# Altium schematic sheet 02-MCU.SchDoc
size A; ApprovedDate: 04/02/2019; AssemblyNumber: ECE315-F19
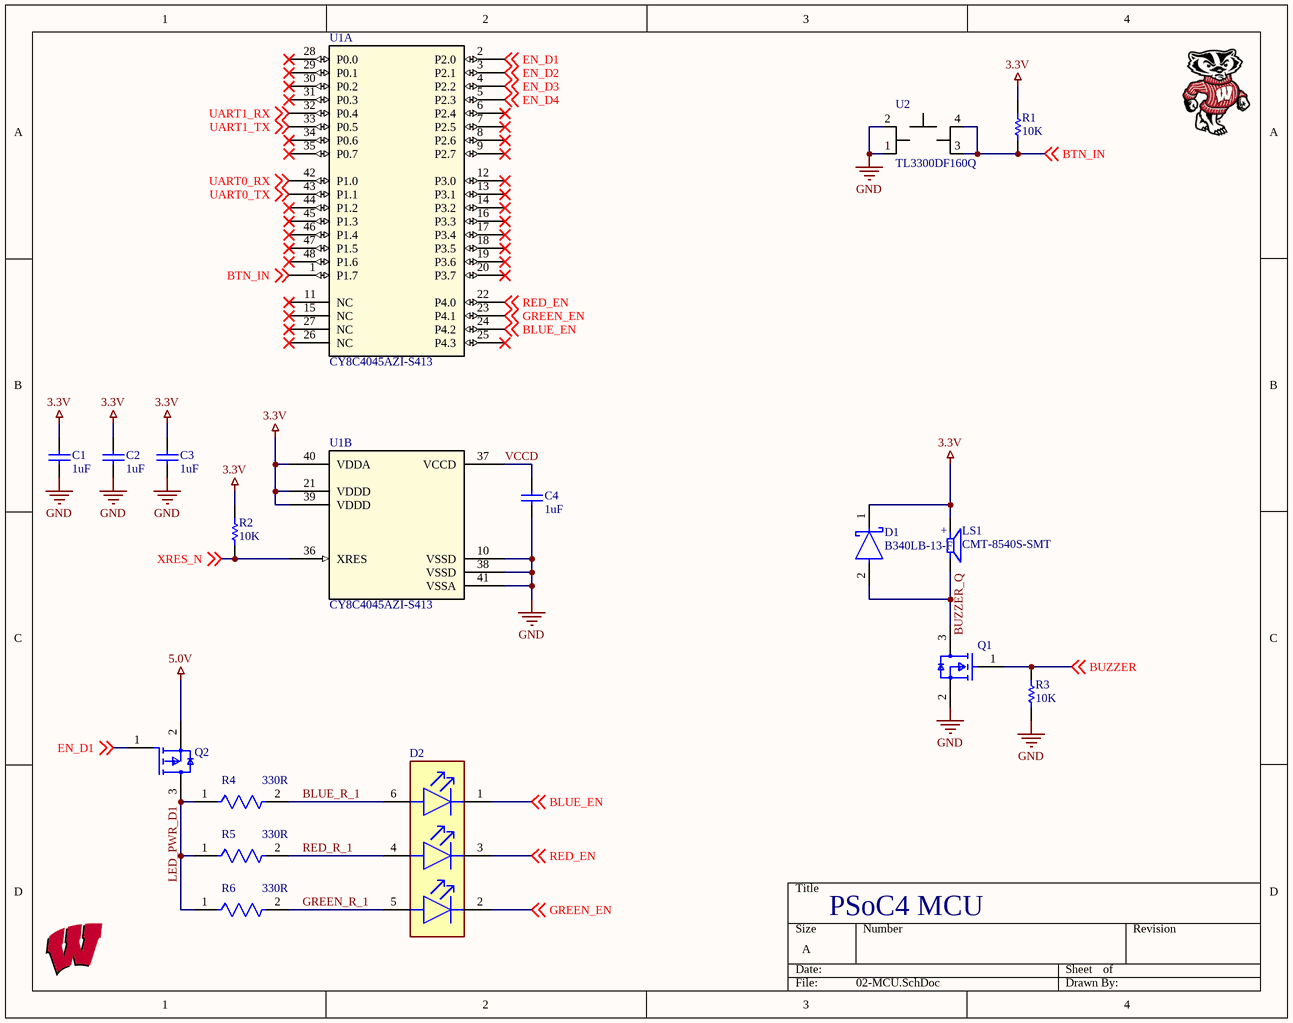
[diagram p0: 02-MCU.SchDoc]

## Parts
C1  Capacitance: 1uF  [CAPC3216X180X50ML20T25]  (hidden comment: C1206C105K3RACTU)
C2  Capacitance: 1uF  [CAPC3216X180X50ML20T25]  (hidden comment: C1206C105K3RACTU)
C3  Capacitance: 1uF  [CAPC3216X180X50ML20T25]  (hidden comment: C1206C105K3RACTU)
C4  Capacitance: 1uF  [CAPC3216X180X50ML20T25]  (hidden comment: C1206C105K3RACTU)
D1  B340LB-13-F  [FP-SMB-MFG]
D2  CLX6F-FKC-CKNNQDGBB7A363  [FP-CLX6F-FKC-CKNNQDGBB7A3-IPC_C]  (value not drawn)
LS1  CMT-8540S-SMT  [CUI_CMT-8540S-SMT]
Q1  2N7002ET1G  [FP-318-08-IPC_A]  (value not drawn)
Q2  DMP3099L-7  [FP-SOT23-IPC_B]  (value not drawn)
R1  Resistance: 10K  [RESC3116X65X40ML10T20]  (hidden comment: RC1206FR-0710KL)
R2  Resistance: 10K  [RESC3116X65X40ML10T20]  (hidden comment: RC1206FR-0710KL)
R3  Resistance: 10K  [RESC3116X65X40ML10T20]  (hidden comment: RC1206FR-0710KL)
R4  Resistance: 330R  [FP-CRCW1206-e3-IPC_A]  (hidden comment: CRCW1206330RFKEA)
R5  Resistance: 330R  [FP-CRCW1206-e3-IPC_A]  (hidden comment: CRCW1206330RFKEA)
R6  Resistance: 330R  [FP-CRCW1206-e3-IPC_A]  (hidden comment: CRCW1206330RFKEA)
U1  CY8C4045AZI-S413  [TQFP48_7X7X1P4_CYP-M]  (parts A,B of 2)
U2  TL3300DF160Q  [TL3300DF160Q]

## Nets
3.3V: C1.2 C2.2 C3.2 D1.1(C) LS1.P R1.2 R2.2 U1.21(VDDD) U1.39(VDDD) U1.40(VDDA)
5.0V: Q2.2(S)
GND: C1.1 C2.1 C3.1 C4.1 Q1.2(Source) R3.1 U1.10(VSSD) U1.38(VSSD) U1.41(VSSA) U2.1 U2.2
BLUE_EN: D2.1(BLUE_C) U1.24(P4.2) ; off-sheet BLUE_EN
BLUE_R_1: D2.6(BLUE_A) R4.2
BTN_IN: R1.1 U1.1(P1.7) U2.3 U2.4(VCCIO) ; off-sheet BTN_IN
BUZZER: Q1.1(Gate) R3.2 ; off-sheet BUZZER
BUZZER_Q: D1.2(A) LS1.N Q1.3(Drain)
EN_D1: Q2.1(G) U1.2(P2.0) ; off-sheet EN_D1
EN_D2: U1.3(P2.1) ; off-sheet EN_D2
EN_D3: U1.4(P2.2) ; off-sheet EN_D3
EN_D4: U1.5(P2.3) ; off-sheet EN_D4
GREEN_EN: D2.2(GREEN_C) U1.23(P4.1) ; off-sheet GREEN_EN
GREEN_R_1: D2.5(GREEN_A) R6.2
LED_PWR_D1: Q2.3(D) R4.1 R5.1 R6.1
RED_EN: D2.3(RED_C) U1.22(P4.0) ; off-sheet RED_EN
RED_R_1: D2.4(RED_A) R5.2
UART0_RX: U1.42(P1.0) ; off-sheet UART0_RX
UART0_TX: U1.43(P1.1) ; off-sheet UART0_TX
UART1_RX: U1.32(P0.4) ; off-sheet UART1_RX
UART1_TX: U1.33(P0.5) ; off-sheet UART1_TX
VCCD: C4.2 U1.37(VCCD)
XRES_N: R2.1 U1.36(XRES) ; off-sheet XRES_N

Not connected (* = marked no-connect by the designer): U1 6(P2.4)* 7(P2.5)* 8(P2.6)* 9(P2.7)* 11(NC)* 12(P3.0)* 13(P3.1)* 14(P3.2)* 15(NC)* 16(P3.3)* 17(P3.4)* 18(P3.5)* 19(P3.6)* 20(P3.7)* 25(P4.3)* 26(NC)* 27(NC)* 28(P0.0)* 29(P0.1)* 30(P0.2)* 31(P0.3)* 34(P0.6)* 35(P0.7)* 44(P1.2)* 45(P1.3)* 46(P1.4)* 47(P1.5)* 48(P1.6)*

## Notes on the sheet
- PSoC4 MCU
- (in symbol CMT-8540S-SMT) +

## Library data of the parts
C1-C4 = CMP-2000-04991-1: Chip Capacitor, 1 uF, +/- 10%, 25 V, -55 to 125 degC, 1206 (3216 Metric), RoHS, Tape and Reel; Manufacturer: Kemet; Temperature Coefficient / Code: +/-15%; Dielectric: X7R; Voltage Rating DC: 25V; Capacitance - nF: 1000nF; Class: Class1; Case Length: 3.2mm; Type: SMDMLCCX7R6.3-250VDCCommericalGrade; Case Width: 1.6mm; Product: GeneralTypeMLCCs; Datasheet URL: https://ciiva.com/datasheet-click-18194173?src=ciiva&sig=6daff8c4; Operating Temperature Range: -55Cto+125C; Series: C1206C; RoHS: Details; Product Category: MultilayerCeramicCapacitorsMLCC-SMD/SMT; Manufacturer URL: http://www.kemet.com/; Minimum Operating Temperature: -55C; Dimensions: 1.6mmWx3.2mmLx1.6mmH; Termination Style: SMD/SMT; Brand: Kemet; Packaging: Reel; Package / Case: 1206(3216metric); Case Code - mm: 3216; Datasheet Version: Jul-14; Factory Pack Quantity: 2000; Package Description: 2-Pin Surface Mount Device, Body 3.2 x 1.6 mm; Tolerance: 10%; Package Reference: 1206; Case Height: 1.6mm; Case Code - in: 1206; Maximum Operating Temperature: +125C; Voltage Rating: 25V; Supplier 1: Digi-Key; Supplier Part Number 1: 399-C1206C105K3RAC7800CT-ND; Manufacturer Part Number: C1206C105K3RACTU; Category: Ceramic Capacitors; Stock 1: 908349; Pricing 1: 1=0.24000, 10=0.16700, 50=0.10000, 100=0.08440, 500=0.05778, 1000=0.05111 (USD); Mount: Surface Mount; Case/Package: 1206; Case Code (Imperial): 1206; Case Code (Metric): 3216; Min Operating Temperature: -55°C; Max Operating Temperature: 125°C; Voltage Rating (DC): 25V; Package Quantity: 1; Termination: SMD/SMT; Construction: Flat; Voltage: 25V; Length: 3.2mm; Width: 0.063inch; Height: 1.6mm; Depth: 1.6mm; Thickness: 0.055inch; Radiation Hardening: No; Reach SVHC Compliant: No; RoHS Compliant: Yes
D1 = CMP-12790-000022-1: DIODE SCHOTTKY 40V 3A SMB; Manufacturer: Diodes Inc.; Max Surge Forward Current: 70A; Value: 180pF; Peak Reverse Current: 2mA; Standoff Height: 0.05mm; Max Junction Temp: +150°C; Forward Voltage: 450mV; Element Configuration: Single; Polarity: Standard; Device Class L2: Diodes; Octopart: https://octopart.com/b340lb-13-f-diodes+inc.-325823; Device Class L1: Discrete Semiconductors; Forward Current: 3A; Automotive: No; Manufacturer Part Number: B340LB-13-F; Temperature: -55°C to +150°C; Temperature Range Low: -55°C; Max Repetitive Reverse Voltage: 40V; Device Class L3: Schottky Diodes; RoHS: TRUE; Height: 2.5mm; ComponentLink2URL: https://www.diodes.com/assets/Datasheets/ds30240.pdf; Package: SMB; Digikey Description: DIODE SCHOTTKY 40V 3A SMB; Lead Free: Yes; Category: Diode; Reverse Voltage: 40V; Mouser Description: Schottky Diodes & Rectifiers 40V 3A; ComponentLink2Description: Datasheet; Footprint Url: https://www.diodes.com/assets/Package-Files/SMB.pdf; Temperature Range High: +150°C; Capacitance: 180pF; Supplier 1: Digi-Key; Supplier Part Number 1: B340LB-FDICT-ND; Stock 1: 168517; Pricing 1: 1=0.43000, 10=0.36500, 100=0.27250, 500=0.21414, 1000=0.16547 (USD); Mount: Surface Mount; Case/Package: SMB; Number of Pins: 2; Weight: 0.00328oz; Min Operating Temperature: -55°C; Max Operating Temperature: 125°C; Max Reverse Current: 2mA; Package Quantity: 3000; Packaging: Tape and Reel; Average Rectified Current: 3A; Max Repetitive Reverse Voltage (Vrrm): 40V; Peak Non-Repetitive Surge Current: 70A; Max Forward Surge Current (Ifsm): 70A; Max Reverse Voltage (DC): 40V; Series: -; Voltage Rating (DC): 40V; Current Rating: 3A; Output Current: 3A; Termination: SMD/SMT; Current: 3A; Voltage: 40V; Length: 4.57mm; Width: 3.94mm; Radiation Hardening: No; Reach SVHC Compliant: Yes; RoHS Compliant: Yes; ComponentLink1URL: https://datasheet.ciiva.com/4715/ds30240-71143-4715794.pdf?src-supplier=Mouser; ComponentLink1Description: https://datasheet.ciiva.com/4715/ds30240-71143-4715794.pdf?src-supplier=Mouser; ComponentLink3URL: https://datasheet.ciiva.com/26949/getdatasheetpartid-146318-26949355.pdf?src-supplier=Verical; ComponentLink3Description: https://datasheet.ciiva.com/26949/getdatasheetpartid-146318-26949355.pdf?src-supplier=Verical; ComponentLink4URL: https://datasheet.ciiva.com/1177/ds30240-1177479.pdf?src-supplier=Element14; ComponentLink4Description: https://datasheet.ciiva.com/1177/ds30240-1177479.pdf?src-supplier=Element14; ComponentLink5URL: https://datasheet.ciiva.com/16380/ds30240-16380877.pdf?src-supplier=Future+Electronics; ComponentLink5Description: https://datasheet.ciiva.com/16380/ds30240-16380877.pdf?src-supplier=Future+Electronics; ComponentLink6URL: https://datasheet.ciiva.com/8303/ds30240-8303077.pdf?src-supplier=Avnet; ComponentLink6Description: https://datasheet.ciiva.com/8303/ds30240-8303077.pdf?src-supplier=Avnet; ComponentLink7URL: https://datasheet.ciiva.com/914/ds30240-914107.pdf?src-supplier=Digi-Key; ComponentLink7Description: https://datasheet.ciiva.com/914/ds30240-914107.pdf?src-supplier=Digi-Key; ComponentLink8URL: https://datasheet.ciiva.com/914/ds30240-914108.pdf?src-supplier=Digi-Key; ComponentLink8Description: https://datasheet.ciiva.com/914/ds30240-914108.pdf?src-supplier=Digi-Key; ComponentLink9URL: https://datasheet.ciiva.com/914/ds30240-914106.pdf?src-supplier=Digi-Key; ComponentLink9Description: https://datasheet.ciiva.com/914/ds30240-914106.pdf?src-supplier=Digi-Key; Supplier 2: Newark; Supplier Part Number 2: 12T1468
D2 = CMP-240906-000003-1: LED RGB 6PLCC SMD; Manufacturer 1: Cree; Lens Style: Flat; Temperature Coefficient: 25ppm/°C; Test Current: 10mA; Color: Blue; Max Power Dissipation: 400mW; Dominant Wavelength: 470nm; Tolerance: 0.1%; Resistance: 49.9R; Forward Voltage: 3V; Luminous Intensity: 240mcd; Case Code (Imperial): 1206; Features: Moisture Resistant; RoHS Compliant: Yes; Case Code (Metric): 3216; Packaging: Cut Tape; Max Operating Temperature: 155°C; Case/Package: SMD/SMT; Mount: Surface Mount; Height: 2.9mm; Resistor Type: Thin Film; Min Operating Temperature: -55°C; Length: 3.4mm; Number of Terminations: 2; Width: 3.4mm; Supplier 1: Digi-Key; Supplier Part Number 1: CLX6F-FKC-CKNNQDGBB7A363CT-ND; Manufacturer Part Number 1: CLX6F-FKC-CKNNQDGBB7A363; RoHS: Yes; Category: Uncategorized; Stock 1: 28879; Pricing 1: 1=0.36000, 10=0.33500, 100=0.30960, 1000=0.27700 (USD); ComponentLink1URL: http://www.farnell.com/datasheets/2813756.pdf?src-supplier=Farnell; ComponentLink1Description: http://www.farnell.com/datasheets/2813756.pdf?src-supplier=Farnell; ComponentLink2URL: http://www.mouser.com/ds/2/90/CLX6F-FKC-1352-1064258.pdf?src-supplier=Mouser; ComponentLink2Description: http://www.mouser.com/ds/2/90/CLX6F-FKC-1352-1064258.pdf?src-supplier=Mouser; ComponentLink3URL: https://www.cree.com/led-components/media/documents/CLX6F-FKC-1352.pdf?src-supplier=Digi-Key; ComponentLink3Description: https://www.cree.com/led-components/media/documents/CLX6F-FKC-1352.pdf?src-supplier=Digi-Key; ComponentLink4URL: http://www.farnell.com/datasheets/2813756.pdf?src-supplier=Element14; ComponentLink4Description: http://www.farnell.com/datasheets/2813756.pdf?src-supplier=Element14; ComponentLink5URL: http://www.farnell.com/datasheets/2813756.pdf?src-supplier=Newark; ComponentLink5Description: http://www.farnell.com/datasheets/2813756.pdf?src-supplier=Newark
LS1 = CMT-8540S-SMT: AUDIO MAGNETIC XDCR 1-6V SMD; Manufacturer 1: CUI; MF: CUI Devices; MP: CMT-8540S-SMT-TR; Voltage Rating: 5V; Frequency: 4kHz; Operating Supply Current: 150mA; CUI_purchase_URL: https://www.cuidevices.com/product/audio/buzzers/audio-transducers/cmt-8540s-smt-tr?utm_source=snapeda.com&utm_medium=referral&utm_campaign=snapedaBOM; SnapEDA_Link: https://www.snapeda.com/parts/CMT-8540S-SMT-TR/CUI%20Devices/view-part/587791/?ref=snap; Availability: Unavailable; Package: CUI Inc.; Value: *; Price: None; Supplier 1: Digi-Key; Supplier Part Number 1: 102-3746-1-ND; Manufacturer Part Number 1: CMT-8540S-SMT-TR; RoHS: Yes; Category: Audio Products; Stock 1: 66147; Pricing 1: 1=3.23000, 10=2.67000, 25=2.46400, 50=2.31400, 100=2.16990, 500=1.91520 (USD); Min Operating Temperature: -20°C; Max Operating Temperature: 70°C; Sensing Method: Magnetic; Lead Free: Lead Free; ComponentLink1URL: https://www.cui.com/product/resource/digikeypdf/cmt-8540s-smt.pdf?src-supplier=Digi-Key; ComponentLink1Description: https://www.cui.com/product/resource/digikeypdf/cmt-8540s-smt.pdf?src-supplier=Digi-Key
Q1 = CMP-1058-00769-2: MOSFET N-CH 60V 260MA SOT-23; On-State Resistance: 2.5R; Turn-Off Delay Time: 4.8ns; Nominal Vgs: 1V; Element Configuration: Single; Rise Time: 1.2ns; Input Capacitance: 26.7pF; Number of Elements: 1; Turn-On Delay Time: 1.7ns; Gate to Source Voltage (Vgs): 20V; Max Power Dissipation: 300mW; Drain to Source Breakdown Voltage: 60V; Max Operating Temperature: 150°C; REACH SVHC: No SVHC; Case/Package: SOT-23-3; Lead Free: Lead Free; Length: 2.9mm; Height: 0.94mm; Package Quantity: 3000; Min Operating Temperature: -55°C; Radiation Hardening: No; Packaging: Tape and Reel; Fall Time: 1.2ns; Drain to Source Resistance: 2.5R; Halogen Free: Halogen Free; Threshold Voltage: 1V; Number of Pins: 3; Continuous Drain Current (ID): 260mA; Rds On Max: 2.5R; Power Dissipation: 300mW; Width: 1.3mm
Q2 = CMP-12801-000062-2: MOSFET P-CH 30V SOT23; Manufacturer: Diodes; Gate to Source Voltage (Vgs): 20V; Turn-Off Delay Time: 31ns; Drain to Source Voltage (Vdss): -30V; Fall Time: 15ns; Threshold Voltage: -2.1V; Rise Time: 5ns; Input Capacitance: 563pF; Number of Channels: 1; Drain to Source Resistance: 65mR; Element Configuration: Single; Max Power Dissipation: 1.08W; Turn-On Delay Time: 4.8ns; Continuous Drain Current (ID): 3.8A; Polarity: P-CHANNEL; Lead Free: Lead Free; Number of Pins: 3; Package Quantity: 3000; Width: 1.4mm; Radiation Hardening: No; Mount: Surface Mount; Case/Package: SOT-23; Contact Plating: Tin; Rds On Max: 65mR; Height: 1.1mm; REACH SVHC: No SVHC; Weight: 0.000282oz; Max Operating Temperature: 150°C; Packaging: Tape and Reel; Min Operating Temperature: -55°C; Length: 3mm; Supplier 1: Digi-Key; Supplier Part Number 1: DMP3099L-7DICT-ND; Manufacturer Part Number: DMP3099L-7; RoHS: Yes; Category: MOSFETs; Stock 1: 461842; Pricing 1: 1=0.36000, 10=0.26500, 100=0.14980, 500=0.09922, 1000=0.07607 (USD); Series: -; RoHS Compliant: Yes; Reach SVHC Compliant: Yes; ComponentLink1URL: http://www.farnell.com/datasheets/2040103.pdf?src-supplier=Farnell; ComponentLink1Description: http://www.farnell.com/datasheets/2040103.pdf?src-supplier=Farnell; ComponentLink2URL: http://www.mouser.com/ds/2/115/DMP3099L-266220.pdf?src-supplier=Mouser; ComponentLink2Description: http://www.mouser.com/ds/2/115/DMP3099L-266220.pdf?src-supplier=Mouser; ComponentLink3URL: http://www.alliedelec.com/m/d/a7453f83181edfde31570147b9d1ef2f.pdf?src-supplier=Allied+Electronics; ComponentLink3Description: http://www.alliedelec.com/m/d/a7453f83181edfde31570147b9d1ef2f.pdf?src-supplier=Allied+Electronics; ComponentLink4URL: http://www.farnell.com/datasheets/2040103.pdf?src-supplier=Element14; ComponentLink4Description: http://www.farnell.com/datasheets/2040103.pdf?src-supplier=Element14; ComponentLink5URL: http://www.farnell.com/datasheets/2040103.pdf?src-supplier=Newark; ComponentLink5Description: http://www.farnell.com/datasheets/2040103.pdf?src-supplier=Newark; ComponentLink6URL: http://www.diodes.com/datasheets/DMP3099L.pdf?src-supplier=Avnet; ComponentLink6Description: http://www.diodes.com/datasheets/DMP3099L.pdf?src-supplier=Avnet; ComponentLink7URL: http://www.diodes.com/datasheets/DMP3099L.pdf?src-supplier=Digi-Key; ComponentLink7Description: http://www.diodes.com/datasheets/DMP3099L.pdf?src-supplier=Digi-Key; ComponentLink8URL: https://www.diodes.com/assets/Datasheets/DMP3099L.pdf?src-supplier=Digi-Key; ComponentLink8Description: https://www.diodes.com/assets/Datasheets/DMP3099L.pdf?src-supplier=Digi-Key; Supplier 2: Newark; Supplier Part Number 2: 82Y6589
R1-R3 = CMP-1014-00623-2: Chip Resistor, 10 KOhm, +/- 1%, 0.25 W, -55 to 155 degC, 1206 (3216 Metric), RoHS, Tape and Reel; Manufacturer: Yageo; Voltage Rating: 200V; Temperature Coefficient: 100ppm/degreesC; Power Rating: 250mW; Packaging: TapeandReel; Termination: SMD/SMT; REACH SVHC: Unknown; Tolerance: 1%; Height: 0.55mm; Composition: ThickFilm; Max Operating Temperature: 155degC; Datasheet Version: Rev. 5, 10/2016; Lead Free: LeadFree; Case Code (Metric): 3216; Depth: 1.6mm; Package Quantity: 5000; RoHSCompliant: true; Military Standard: Not; Case/Package: 1206; Case Code (Imperial): 1206; Min Operating Temperature: -55degC; Datasheet URL: http://www.yageo.com/NewPortal/yageodocoutput?fileName=/pdf/R-Chip/PYu-RC_Group_51_RoHS_L_5.pdf; Length: 3.1mm; Manufacturer URL: http://www.yageo.com/; Package Reference: 1206.0; Width: 1.6mm; Package Description: 2-Pin Surface Mount Device, Body 3.1 x 1.6 mm; Supplier 1: Digi-Key; Supplier Part Number 1: 311-10.0KFRCT-ND; Manufacturer Part Number: RC1206FR-0710KL; RoHS: Yes; Category: Chip SMD Resistors; Stock 1: 3827063; Pricing 1: 1=0.10000, 10=0.03700, 100=0.02040, 1000=0.01236, 2500=0.01036 (USD); Size Code: 1206; Series: RC; Resistance Tolerance: 1%; Resistor Type: Thick Film; Max Power Dissipation: 250mW; Number of Terminations: 2; Construction: Rectangular; Features: Moisture Resistant; RoHS Compliant: Yes; ComponentLink1URL: https://datasheet.ciiva.com/46445/444357-46445703.pdf?src-supplier=Element14; ComponentLink1Description: https://datasheet.ciiva.com/46445/444357-46445703.pdf?src-supplier=Element14; ComponentLink2URL: https://datasheet.ciiva.com/7857/1692832-7857244.pdf?src-supplier=Element14; ComponentLink2Description: https://datasheet.ciiva.com/7857/1692832-7857244.pdf?src-supplier=Element14; ComponentLink3URL: https://datasheet.ciiva.com/7857/1692832-7857245.pdf?src-supplier=Element14; ComponentLink3Description: https://datasheet.ciiva.com/7857/1692832-7857245.pdf?src-supplier=Element14; Supplier 2: Newark; Supplier Part Number 2: 98K7621
R4-R6 = CMP-2003-02098-2: RES Thick Film, 330Ω, 1%, 0.25W, 100ppm/°C, 1206; Manufacturer: Vishay; Voltage Rating: 200V; Max Power Dissipation: 250mW; Height: 0.55mm; Mount: Surface Mount; Min Operating Temperature: -55°C; Depth: 1.6mm; Features: Automotive AEC-Q200; Voltage Rating (DC): 200V; Military Standard: Not; Packaging: Tape and Reel; Composition: Thick Film; Contact Plating: Tin; Case Code (Imperial): 1206; Case/Package: 1206; Number of Terminations: 2; Length: 3.2mm; Lead Free: Lead Free; Tolerance: 1%; Temperature Coefficient: 100ppm/°C; Case Code (Metric): 3216; Width: 1.6mm; Weight: 0.000353oz; Termination: SMD/SMT; Radiation Hardening: No; Package Quantity: 10; Power Rating: 250mW; Max Operating Temperature: 155°C; Supplier 1: Newark; Supplier Part Number 1: 53K2302; Manufacturer Part Number: CRCW1206330RFKEA; RoHS: Yes; Category: Chip SMD Resistors; Stock 1: 4253; Pricing 1: 1=0.10000, 25=0.07500, 50=0.05400, 100=0.03300 (USD); Size Code: 1206; Series: CRCW; Construction: Rectangular; Resistor Type: Thick Film; Resistance Tolerance: 1%; Technology: THICK FILM; RoHS Compliant: Yes; ComponentLink1URL: https://datasheet.ciiva.com/3882/41397335s9853079n6892-3882805.pdf?src-supplier=Arrow+Electronics; ComponentLink1Description: https://datasheet.ciiva.com/3882/41397335s9853079n6892-3882805.pdf?src-supplier=Arrow+Electronics; ComponentLink2URL: https://datasheet.ciiva.com/11811/0900766b80d98b5e-11811057.pdf?src-supplier=Rs; ComponentLink2Description: https://datasheet.ciiva.com/11811/0900766b80d98b5e-11811057.pdf?src-supplier=Rs; ComponentLink3URL: https://datasheet.ciiva.com/8944/dcrcwe3-8944790.pdf?src-supplier=Avnet; ComponentLink3Description: https://datasheet.ciiva.com/8944/dcrcwe3-8944790.pdf?src-supplier=Avnet; ComponentLink4URL: https://datasheet.ciiva.com/8944/dcrcwe3-8944796.pdf?src-supplier=Avnet; ComponentLink4Description: https://datasheet.ciiva.com/8944/dcrcwe3-8944796.pdf?src-supplier=Avnet; ComponentLink5URL: https://datasheet.ciiva.com/5548/dcrcwe3-109170-5548614.pdf?src-supplier=Mouser; ComponentLink5Description: https://datasheet.ciiva.com/5548/dcrcwe3-109170-5548614.pdf?src-supplier=Mouser; ComponentLink6URL: https://datasheet.ciiva.com/2468/dcrcwe3-2468856.pdf?src-supplier=Digi-Key; ComponentLink6Description: https://datasheet.ciiva.com/2468/dcrcwe3-2468856.pdf?src-supplier=Digi-Key; ComponentLink7URL: https://datasheet.ciiva.com/2468/dcrcwe3-2468857.pdf?src-supplier=Digi-Key; ComponentLink7Description: https://datasheet.ciiva.com/2468/dcrcwe3-2468857.pdf?src-supplier=Digi-Key; ComponentLink8URL: https://datasheet.ciiva.com/2468/dcrcwe3-2468858.pdf?src-supplier=Digi-Key; ComponentLink8Description: https://datasheet.ciiva.com/2468/dcrcwe3-2468858.pdf?src-supplier=Digi-Key; ComponentLink9URL: https://datasheet.ciiva.com/16766/70201119-16766716.pdf?src-supplier=Allied+Electronics; ComponentLink9Description: https://datasheet.ciiva.com/16766/70201119-16766716.pdf?src-supplier=Allied+Electronics; ComponentLink10URL: https://datasheet.ciiva.com/26317/fld-crcw-e3-data-en-26317131.pdf?src-supplier=Distrelec; ComponentLink10Description: https://datasheet.ciiva.com/26317/fld-crcw-e3-data-en-26317131.pdf?src-supplier=Distrelec; ComponentLink11URL: https://datasheet.ciiva.com/7777/1697337-7777469.pdf?src-supplier=Element14; ComponentLink11Description: https://datasheet.ciiva.com/7777/1697337-7777469.pdf?src-supplier=Element14; ComponentLink12URL: https://datasheet.ciiva.com/22869/70201119-22869980.pdf?src-supplier=Allied+Electronics; ComponentLink12Description: https://datasheet.ciiva.com/22869/70201119-22869980.pdf?src-supplier=Allied+Electronics
U1 = CY8C4045AZI-S413: No Description Available; Mfr_Name: Cypress Semiconductor; RefDes: RefDes; Type: Type
U2 = TL3300DF160Q: Switch Tactile OFF (ON) SPST Round Button Gull Wing 0.05A 12VDC 1.57N SMD; Manufacturer: E-Switch; Contact Rating @ Voltage: 0.05A @ 12VDC; Outline: 12.00mm x 12.00mm; Circuit: SPST-NO; Switch Travel: 0.35mm; Actuator Type: Standard; Mechanical Life: 200,000 Cycles; Switch Function: Off-Mom; Actuator Height off PCB, from Pins: 4.30mm; Illumination: Non-Illuminated; Operating Force: 160gf; Actuator Orientation: Top Actuated; Current Rating: 50mA; Voltage Rating (DC): 12V; Illumination Voltage (Nominal): -; Mounting Type: Surface Mount; Illumination Type, Color: -; Packaging: Cut Tape (CT); Ingress Protection: -; RoHS: RoHS Compliant; Actuator Material: -; Category: Switches; Manufacturer Part Number: TL3300DF160Q; Operating Temperature: -25°C ~ 70°C; Features: -; Termination Style: Gull Wing; Supplier: Digi-Key; Supplier Part Number: EG4906CT-ND; Supplier 1: Digi-Key; Supplier Part Number 1: EG4906CT-ND; Manufacturer 1: E-Switch; Manufacturer Part Number 1: TL3300DF160Q; Stock 1: 57403; Pricing 1: 1=0.60000, 10=0.57800, 25=0.55680, 100=0.48180, 250=0.43896 (USD); Mount: Surface Mount; Case/Package: SMD/SMT; Contact Plating: Silver; Min Operating Temperature: -25°C; Max Operating Temperature: 70°C; Package Quantity: 1; Termination: Gull Wing; Illumination Type: Non-Illuminated; Throw Configuration: SPST; Series: TL3300; RoHS Compliant: Yes; ComponentLink1URL: https://datasheet.ciiva.com/2900/n301101-2900856.pdf?src-supplier=Digi-Key; ComponentLink1Description: https://datasheet.ciiva.com/2900/n301101-2900856.pdf?src-supplier=Digi-Key; ComponentLink2URL: https://datasheet.ciiva.com/2900/n301101-2900858.pdf?src-supplier=Digi-Key; ComponentLink2Description: https://datasheet.ciiva.com/2900/n301101-2900858.pdf?src-supplier=Digi-Key